# Altium schematic sheet Maypole Power.SchDoc
size 292 x 193 mm; Revision: 0.3; SheetNumber: 2; SheetTotal: 3; PROJECT: Maypole; VERSION: 1
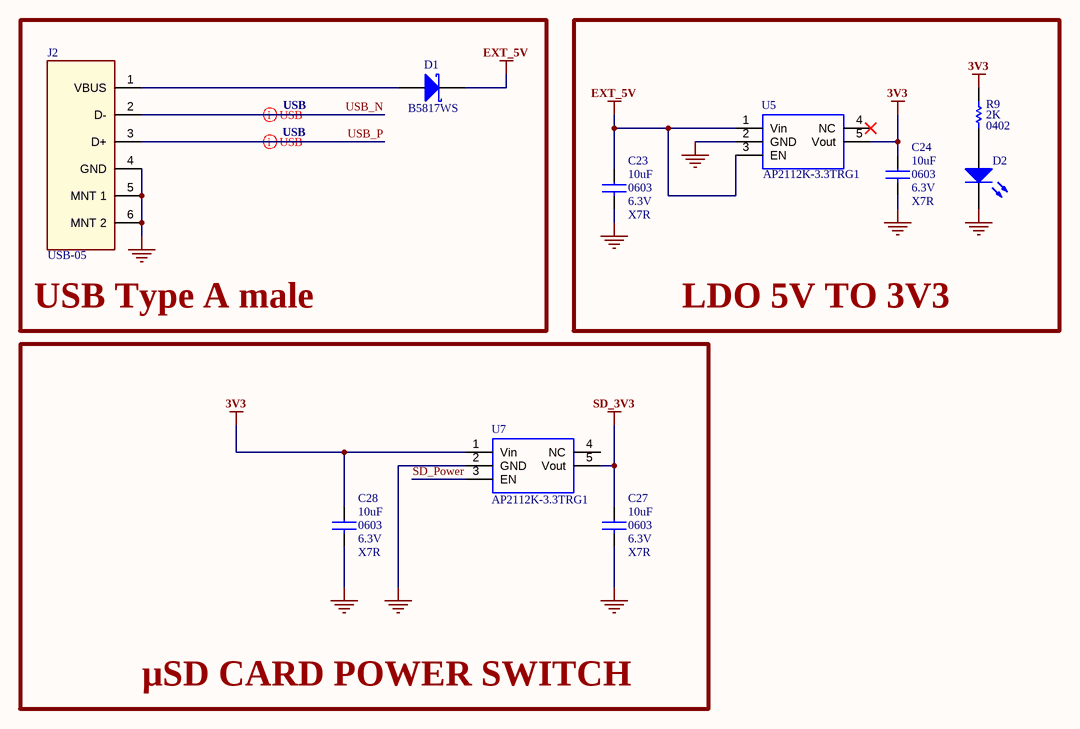
[diagram p0: Maypole Power.SchDoc]

## Parts
C23  value 10uF  Voltage: 6.3V  Dielectric: X7R  Case/Package: 0603  [CAPC0603]
C24  value 10uF  Voltage: 6.3V  Dielectric: X7R  Case/Package: 0603  [CAPC0603]
C27  value 10uF  Voltage: 6.3V  Dielectric: X7R  Case/Package: 0603  [CAPC0603]
C28  value 10uF  Voltage: 6.3V  Dielectric: X7R  Case/Package: 0603  [CAPC0603]
D1  (no value)  [SOD-323]
D2  (no value)  [LED_0603]
J2  Manufacturer Part Number: USB-05  [Molex_48037-0001_0]
R9  value 2K  Case/Package: 0402  [RESC0402]
U5  Manufacturer Part Number: AP2112K-3.3TRG1  [SOT25]
U7  Manufacturer Part Number: AP2112K-3.3TRG1  [SOT25]

## Blocks framed on the sheet
USB Type A male: D1 J2
LDO 5V TO 3V3: C23 C24 D2 R9 U5
μSD CARD POWER SWITCH: C27 C28 U7

## Nets
3V3: C24.1 C28.1 R9.1 U5.5(Vout) U7.1(Vin)
EXT_5V: C23.1 D1.K U5.1(Vin) U5.3(EN)
GND: C23.2 C24.2 C27.2 C28.2 D2.K J2.4(GND) J2.5(MNT_1) J2.6(MNT_2) U5.2(GND) U7.2(GND)
SD_3V3: C27.1 U7.5(Vout)
SD_Power: U7.3(EN)
USB_N: J2.2(D-)
USB_P: J2.3(D+)
NetD1_A: D1.A J2.1(VBUS)
NetD2_A: D2.A R9.2

Not connected (* = marked no-connect by the designer): U5 4(NC)*; U7 4(NC)

## Layout directives
differential pair; net class USB; differential pair class USB: USB_N, USB_P

## Notes on the sheet
- VICHARAK
- TITLE :-
- VERSION :-
- PROJECT :-
- SHEET :-
- OF
- REVISION:-
- DATE :-

## Library data of the parts
C23 C24 C27 C28 = Cap: CAP CER 10uF 6.3V X7R 0603; Manufacturer Part Number: *
D1 = B5817WS: 20V 1A 450mV @ 1A SOD-323 Schottky Barrier Diodes (SBD) RoHS; Manufacturer Part Number: B5817WS; Case/Package: SOD-323
D2 = LED1: LED, RED,SMD, 0603; Case/Package: 0603; Manufacturer Part Number: LED, RED,SMD, 0603
J2 = USB MALE: USB A-type Plug Male PCB R/A; Case/Package: TH
R9 = Resistor: Thick Film Resistor -  2Kohm, 1%, 0402
U5 U7 = LDO_5V_3V: LDO Voltage Regulators 600mA CMOS LDO 50mA 3.3V 250mV; Case/Package: SOT-23-5